# EAGLE schematic Trefferzonenmodul (EAGLE 7.2.0)
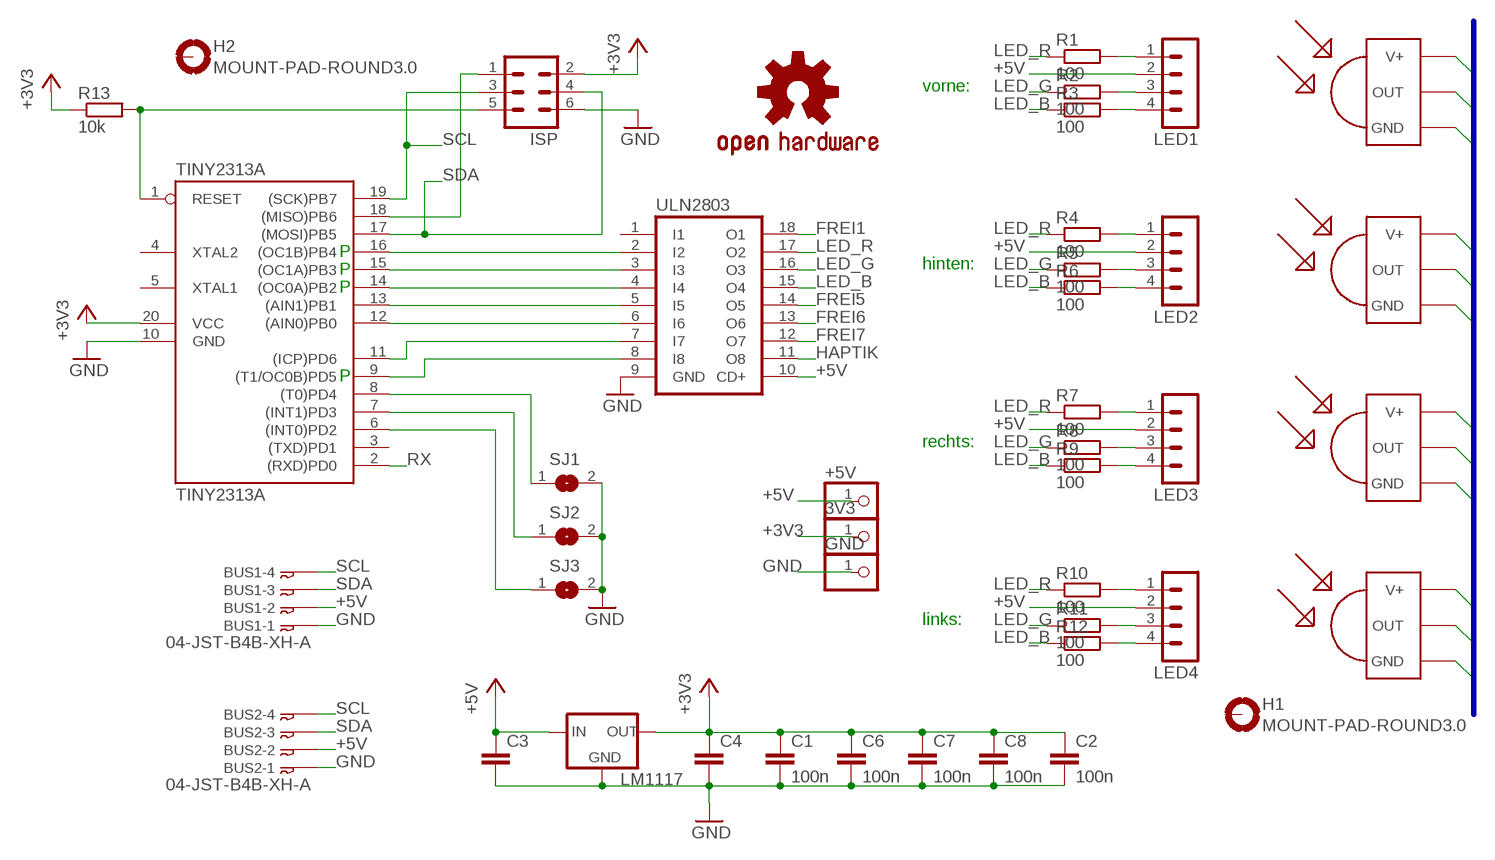
[diagram p0: schematic, sheet 1]

## Parts
3V3  PINHD-1X1  [1X01]
+5V  PINHD-1X1  [1X01]
BUS1  04-JST-B4B-XH-A  [B4B-XH]
BUS2  04-JST-B4B-XH-A  [B4B-XH]
C1  100n  C-EUC0805  [C0805]
C2  100n  C-EUC0805  [C0805]
C3  C-EUCAP_UNIVERSAL  [C1808]
C4  C-EUCAP_UNIVERSAL  [C1808]
C6  100n  C-EUC0805  [C0805]
C7  100n  C-EUC0805  [C0805]
C8  100n  C-EUC0805  [C0805]
GND  PINHD-1X1  [1X01]
H1  MOUNT-PAD-ROUND3.0  [3,0-PAD]
H2  MOUNT-PAD-ROUND3.0  [3,0-PAD]
ISP  MA03-2  [MA03-2]
LED1  MA04-1  [MA04-1]
LED2  MA04-1  [MA04-1]
LED3  MA04-1  [MA04-1]
LED4  MA04-1  [MA04-1]
LM1117  V_REG_MIC2920  [SOT223]
LOGO2  OSHW-LOGOM  [OSHW-LOGO-M]
R1  100  R-EU_R0805  [R0805]
R2  100  R-EU_R0805  [R0805]
R3  100  R-EU_R0805  [R0805]
R4  100  R-EU_R0805  [R0805]
R5  100  R-EU_R0805  [R0805]
R6  100  R-EU_R0805  [R0805]
R7  100  R-EU_R0805  [R0805]
R8  100  R-EU_R0805  [R0805]
R9  100  R-EU_R0805  [R0805]
R10  100  R-EU_R0805  [R0805]
R11  100  R-EU_R0805  [R0805]
R12  100  R-EU_R0805  [R0805]
R13  10k  R-EU_R0805  [R0805]
SJ1  SJ  [SJ]
SJ2  SJ  [SJ]
SJ3  SJ  [SJ]
TINY2313A  TINY2313A  [SO20LVERSTUMMELT]
U$1  TSOP1838  [TSOP18XX]
U$2  TSOP1838  [TSOP18XX]
U$3  TSOP1838  [TSOP18XX]
U$4  TSOP1838  [TSOP18XX]
ULN2803  ULN2803ASO18  [SO18W]

## Nets
+3V3: 3V3.1 C1.1 C2.1 C4.1 C6.1 C7.1 C8.1 ISP.2 LM1117.2(OUT) LM1117.4(OUT) R13.1 TINY2313A.20(VCC) U$1.VCC(V+) U$2.VCC(V+) U$3.VCC(V+) U$4.VCC(V+)
+5V: +5V.1 BUS1.P$2 BUS2.P$2 C3.1 LED1.2 LED2.2 LED3.2 LED4.2 LM1117.3(IN) ULN2803.10(CD+)
FREI1: ULN2803.18(O1)
FREI5: ULN2803.14(O5)
FREI6: ULN2803.13(O6)
FREI7: ULN2803.12(O7)
GND: BUS1.P$1 BUS2.P$1 C1.2 C2.2 C3.2 C4.2 C6.2 C7.2 C8.2 GND.1 ISP.6 LM1117.1(GND) SJ1.2 SJ2.2 SJ3.2 TINY2313A.10(GND) U$1.GND U$2.GND U$3.GND U$4.GND ULN2803.9(GND)
HAPTIK: ULN2803.11(O8)
LED_B: R3.1 R6.1 R9.1 R12.1 ULN2803.15(O4)
LED_G: R2.1 R5.1 R8.1 R11.1 ULN2803.16(O3)
LED_R: R1.1 R4.1 R7.1 R10.1 ULN2803.17(O2)
N$1: ISP.1 TINY2313A.18((MISO)PB6)
N$2: SJ1.1 TINY2313A.8((T0)PD4)
N$3: TINY2313A.16((OC1B)PB4) ULN2803.2(I2)
N$4: TINY2313A.15((OC1A)PB3) ULN2803.3(I3)
N$5: LED4.1 R10.2
N$6: LED4.3 R11.2
N$7: TINY2313A.14((OC0A)PB2) ULN2803.4(I4)
N$8: TINY2313A.13((AIN1)PB1) ULN2803.5(I5)
N$9: TINY2313A.12((AIN0)PB0) ULN2803.6(I6)
N$10: TINY2313A.11((ICP)PD6) ULN2803.7(I7)
N$11: TINY2313A.9((T1/OC0B)PD5) ULN2803.8(I8)
N$12: LED4.4 R12.2
N$13: LED3.1 R7.2
N$14: LED3.3 R8.2
N$15: LED3.4 R9.2
N$16: LED2.1 R4.2
N$17: LED2.3 R5.2
N$18: SJ2.1 TINY2313A.7((INT1)PD3)
N$19: SJ3.1 TINY2313A.6((INT0)PD2)
N$22: LED2.4 R6.2
N$23: ISP.5 R13.2 TINY2313A.1(RESET)
N$24: LED1.1 R1.2
N$25: LED1.3 R2.2
N$26: LED1.4 R3.2
RX: TINY2313A.2((RXD)PD0) U$1.OUT U$2.OUT U$3.OUT U$4.OUT
SCL: BUS1.P$4 BUS2.P$4 ISP.3 TINY2313A.19((SCK)PB7)
SDA: BUS1.P$3 BUS2.P$3 ISP.4 TINY2313A.17((MOSI)PB5)
Unconnected: H1.B3,0(MOUNT) H2.B3,0(MOUNT) TINY2313A.3((TXD)PD1) TINY2313A.4(XTAL2) TINY2313A.5(XTAL1) ULN2803.1(I1)

## Buses
+3V3,GND,RX

## Notes on the sheet
- vorne:
- P
- hinten:
- P
- P
- P
- rechts:
- links:

## Library data of the parts
3V3 +5V GND = wz:PINHD-1X1: PIN HEADER
BUS1 BUS2 = wz:04-JST: JST CONNECTOR
C1-C4 C6-C8 = wz:C-EU: CAPACITOR, European symbol
H1 H2 = holes:MOUNT-PAD-ROUND: MOUNTING PAD, round
ISP = con-lstb:MA03-2: PIN HEADER; OC_FARNELL: unknown; OC_NEWARK: unknown
LED1-LED4 = wz:MA04-1: PIN HEADER; OC_FARNELL: unknown; OC_NEWARK: unknown
LM1117 = wz:V_REG_MIC2920: 1117
LOGO2 = wz:OSHW-LOGO: Open Source Hardware Logo This logo indicates the piece of hardware it is found on incorporates a OSHW license and/or adheres to the definition of open source hardware found here: http://freedomdefined.org/OSHW
R1-R13 = wz:R-EU_: RESISTOR, European symbol
SJ1-SJ3 = jumper:SJ: SMD solder JUMPER
TINY2313A = wz:TINY2313A: MICROCONTROLLER 2 Kbytes FLASH 128 bytes SRAM 128 bytes EEPROM UART
U$1-U$4 = tsop:TSOP1838: IR Receiver and Demodulator
ULN2803 = wz:ULN2803A: DRIVER ARRAY

## Net classes
0 default: width 0.016 mm